# Altium schematic sheet Liv_Flo_Sign_LED_V1.0.SchDoc: Liv-Flo Sign (part 1 of 2)
size 594 x 420 mm; PageSetup: Record=PageOptions|CenterHorizontal=True|CenterVertical=True|PrintScale=0.97|XCorrection=1.00|YCorrection=1.00|PrintKind=0|BorderSize=5000000|LeftOffset=0|BottomOffset=0|Orientation=2|PaperLength=1000|PaperWidth=1000|Scale=100|PaperSource=7|PrintQuality=-3|MediaType=1|DitherType=10|PrintScaleMode=1|PaperKind=A4|PaperIndex=9; Organization: Crelin; Address2: Florian Baumgartner; DocumentNumber: LEDs; Revision: V1.0; SheetNumber: 2; SheetTotal: 2; Author: Florian Baumgartner; Subtitle: Vertically Mounted Daughter-Board
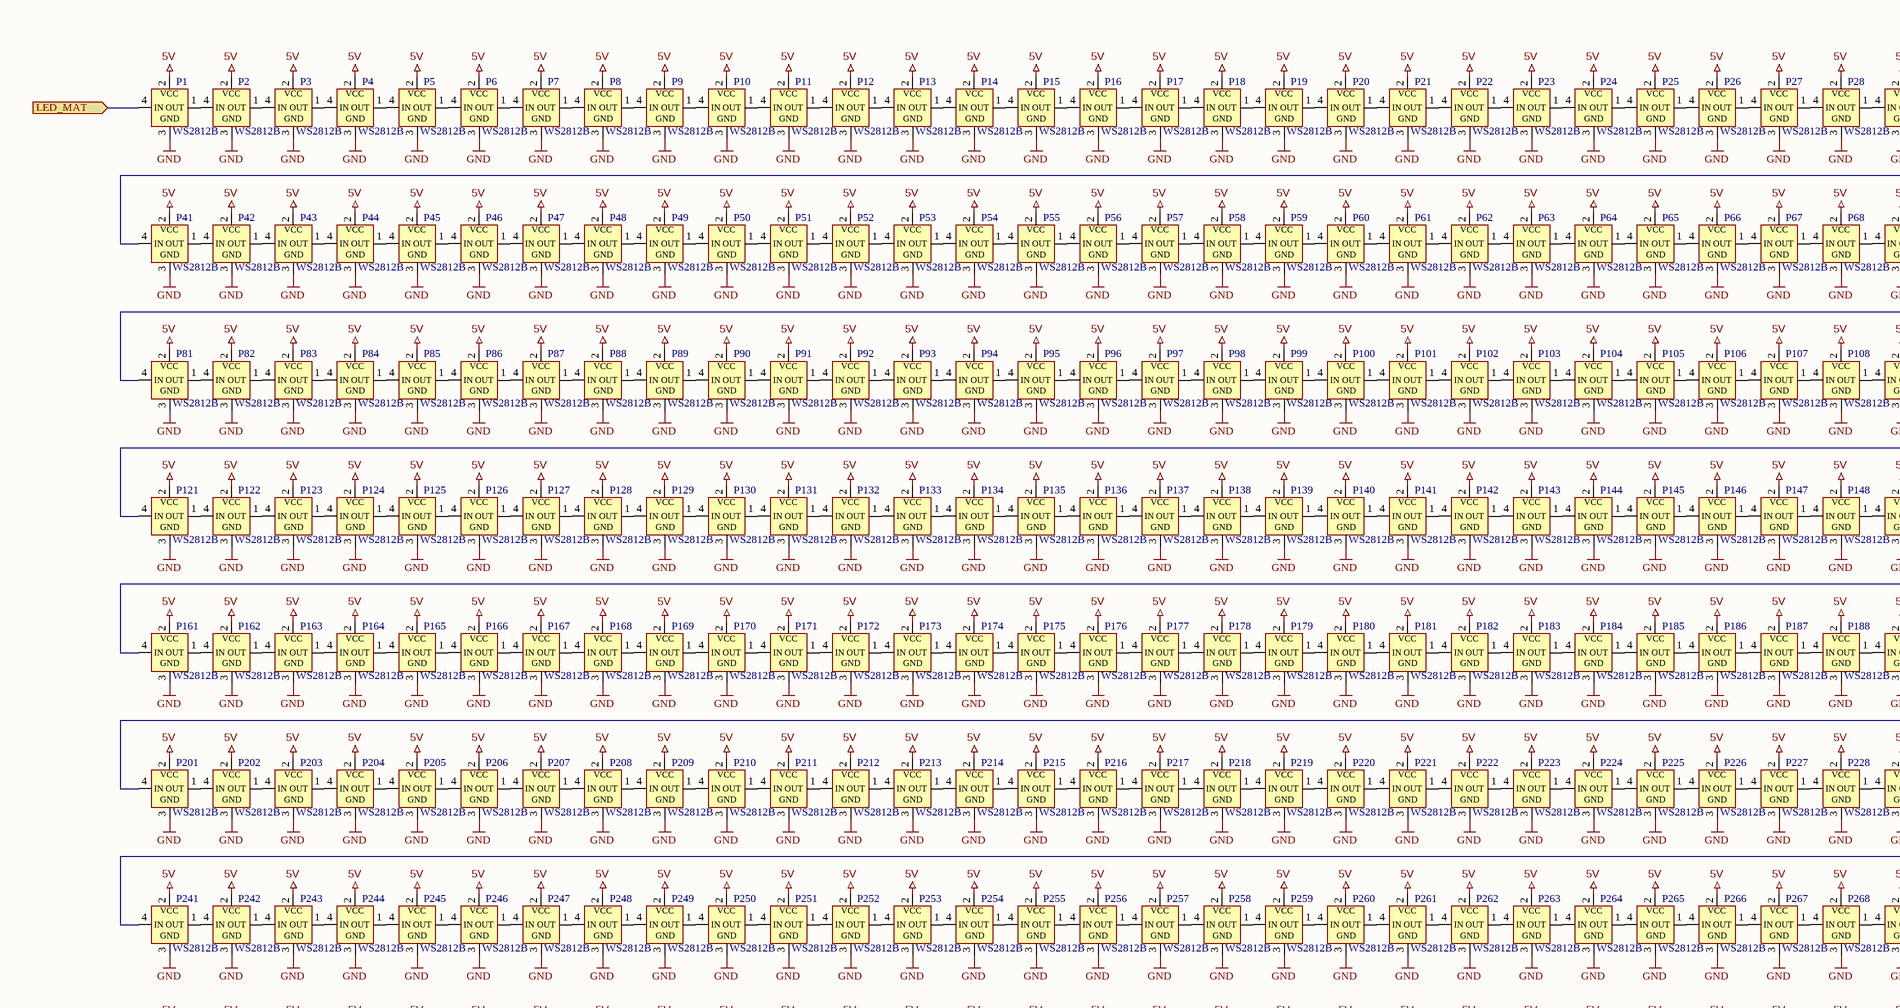
[diagram p0: Liv_Flo_Sign_LED_V1.0.SchDoc, top left]
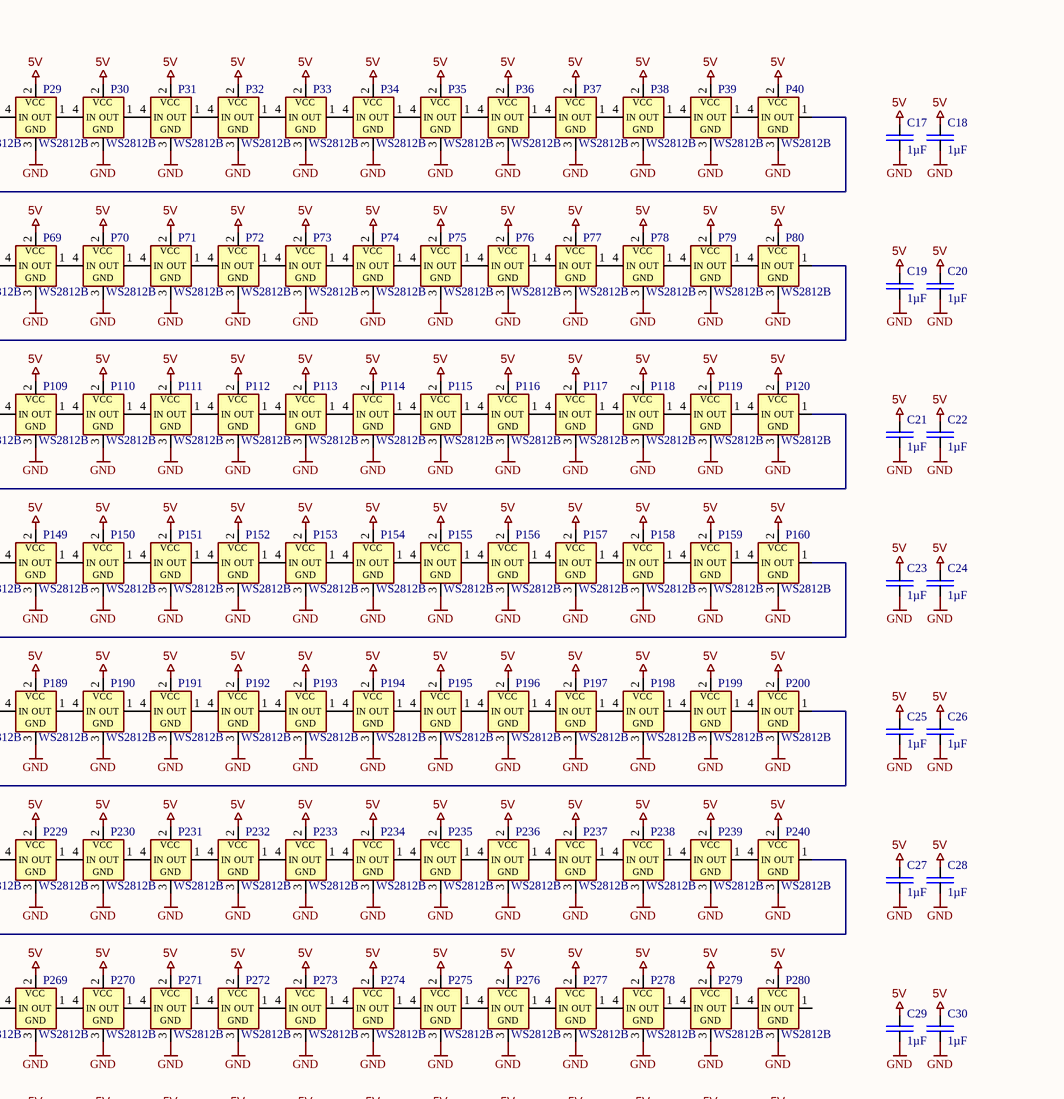
[diagram p1: Liv_Flo_Sign_LED_V1.0.SchDoc, top right]
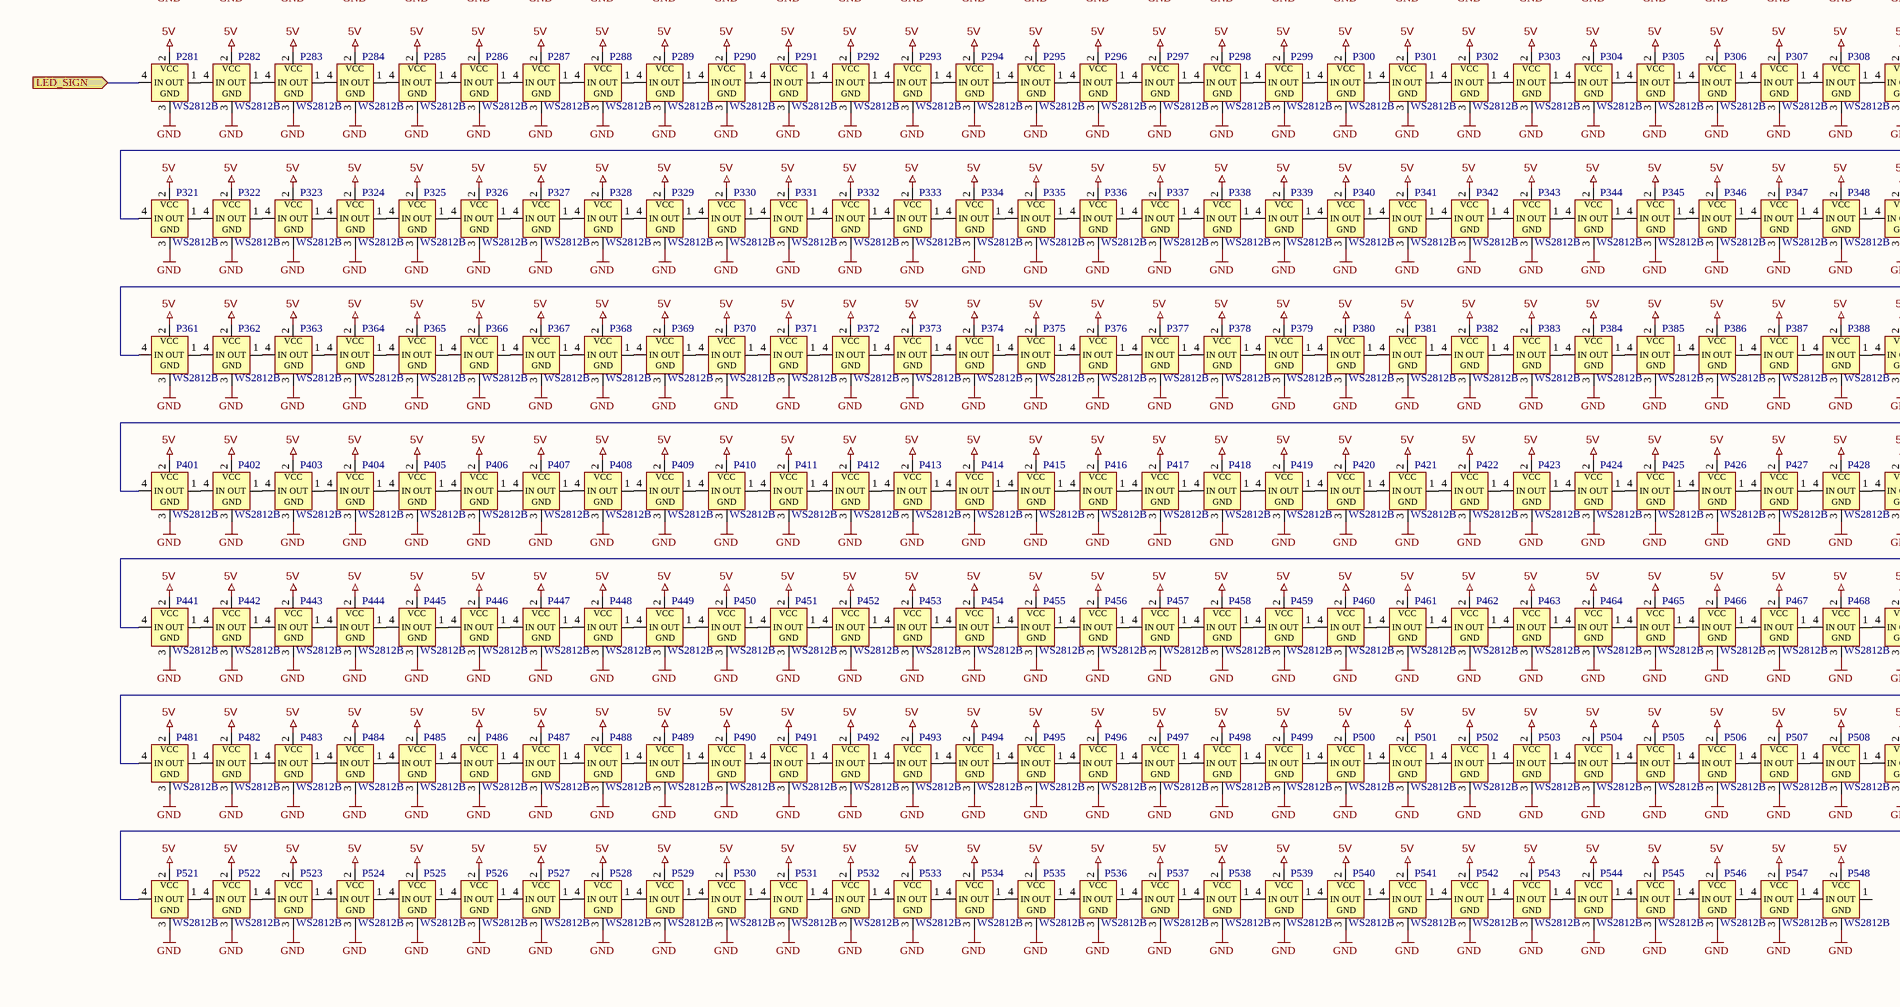
[diagram p2: Liv_Flo_Sign_LED_V1.0.SchDoc, bottom left]
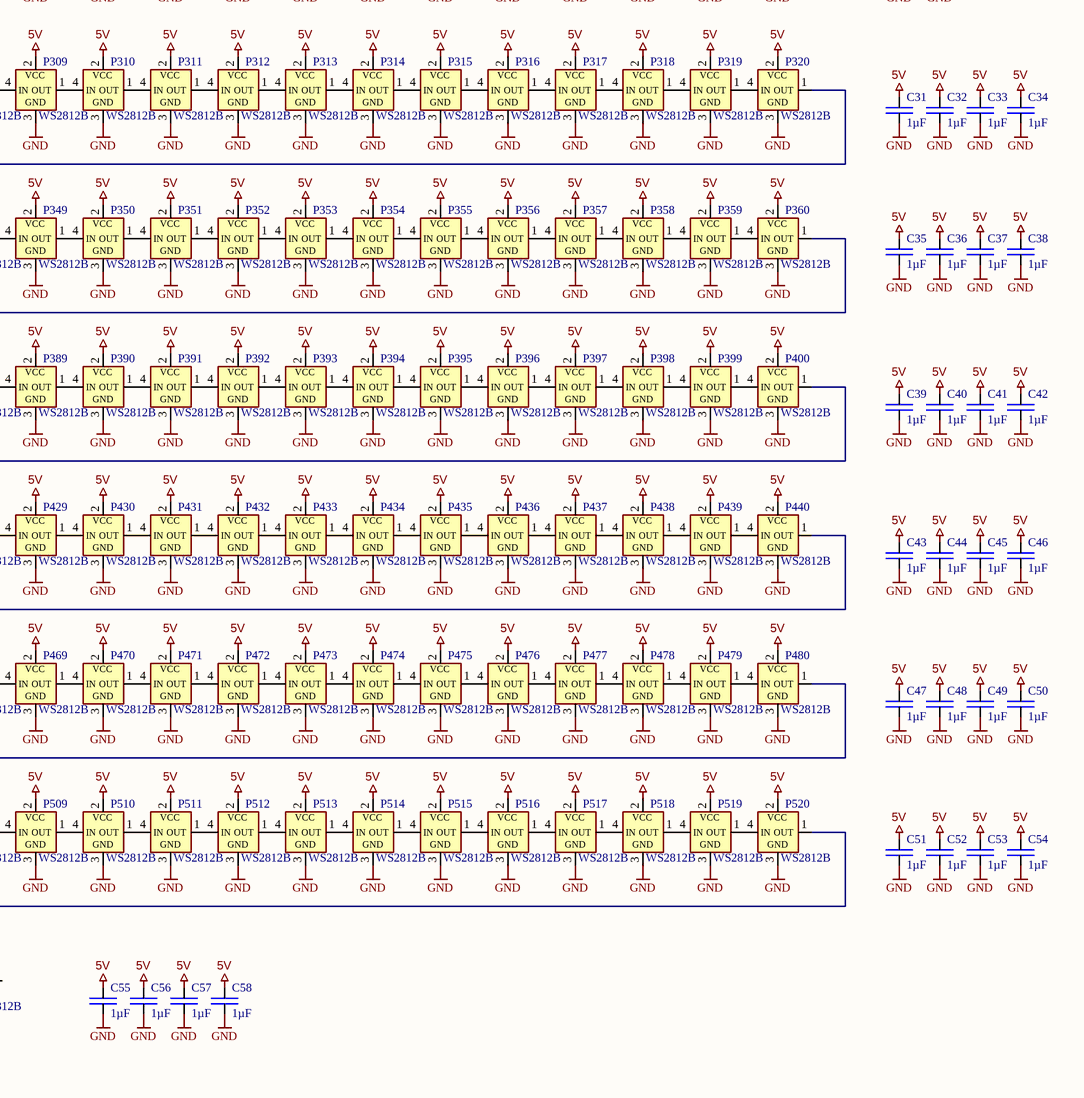
[diagram p3: Liv_Flo_Sign_LED_V1.0.SchDoc, bottom right]

## Parts
C17  1µF  [SMD Keramikkondensator 0402]
C18  1µF  [SMD Keramikkondensator 0402]
C19  1µF  [SMD Keramikkondensator 0402]
C20  1µF  [SMD Keramikkondensator 0402]
C21  1µF  [SMD Keramikkondensator 0402]
C22  1µF  [SMD Keramikkondensator 0402]
C23  1µF  [SMD Keramikkondensator 0402]
C24  1µF  [SMD Keramikkondensator 0402]
C25  1µF  [SMD Keramikkondensator 0402]
C26  1µF  [SMD Keramikkondensator 0402]
C27  1µF  [SMD Keramikkondensator 0402]
C28  1µF  [SMD Keramikkondensator 0402]
C29  1µF  [SMD Keramikkondensator 0402]
C30  1µF  [SMD Keramikkondensator 0402]
C31  1µF  [SMD Keramikkondensator 0402]
C32  1µF  [SMD Keramikkondensator 0402]
C33  1µF  [SMD Keramikkondensator 0402]
C34  1µF  [SMD Keramikkondensator 0402]
C35  1µF  [SMD Keramikkondensator 0402]
C36  1µF  [SMD Keramikkondensator 0402]
C37  1µF  [SMD Keramikkondensator 0402]
C38  1µF  [SMD Keramikkondensator 0402]
C39  1µF  [SMD Keramikkondensator 0402]
C40  1µF  [SMD Keramikkondensator 0402]
C41  1µF  [SMD Keramikkondensator 0402]
C42  1µF  [SMD Keramikkondensator 0402]
C43  1µF  [SMD Keramikkondensator 0402]
C44  1µF  [SMD Keramikkondensator 0402]
C45  1µF  [SMD Keramikkondensator 0402]
C46  1µF  [SMD Keramikkondensator 0402]
C47  1µF  [SMD Keramikkondensator 0402]
C48  1µF  [SMD Keramikkondensator 0402]
C49  1µF  [SMD Keramikkondensator 0402]
C50  1µF  [SMD Keramikkondensator 0402]
C51  1µF  [SMD Keramikkondensator 0402]
C52  1µF  [SMD Keramikkondensator 0402]
C53  1µF  [SMD Keramikkondensator 0402]
C54  1µF  [SMD Keramikkondensator 0402]
C55  1µF  [SMD Keramikkondensator 0402]
C56  1µF  [SMD Keramikkondensator 0402]
C57  1µF  [SMD Keramikkondensator 0402]
C58  1µF  [SMD Keramikkondensator 0402]
P1  WS2812B  [SMD LED WS2812B-1010RGBC]
P2  WS2812B  [SMD LED WS2812B-1010RGBC]
P3  WS2812B  [SMD LED WS2812B-1010RGBC]
P4  WS2812B  [SMD LED WS2812B-1010RGBC]
P5  WS2812B  [SMD LED WS2812B-1010RGBC]
P6  WS2812B  [SMD LED WS2812B-1010RGBC]
P7  WS2812B  [SMD LED WS2812B-1010RGBC]
P8  WS2812B  [SMD LED WS2812B-1010RGBC]
P9  WS2812B  [SMD LED WS2812B-1010RGBC]
P10  WS2812B  [SMD LED WS2812B-1010RGBC]
P11  WS2812B  [SMD LED WS2812B-1010RGBC]
P12  WS2812B  [SMD LED WS2812B-1010RGBC]
P13  WS2812B  [SMD LED WS2812B-1010RGBC]
P14  WS2812B  [SMD LED WS2812B-1010RGBC]
P15  WS2812B  [SMD LED WS2812B-1010RGBC]
P16  WS2812B  [SMD LED WS2812B-1010RGBC]
P17  WS2812B  [SMD LED WS2812B-1010RGBC]
P18  WS2812B  [SMD LED WS2812B-1010RGBC]
P19  WS2812B  [SMD LED WS2812B-1010RGBC]
P20  WS2812B  [SMD LED WS2812B-1010RGBC]
P21  WS2812B  [SMD LED WS2812B-1010RGBC]
P22  WS2812B  [SMD LED WS2812B-1010RGBC]
P23  WS2812B  [SMD LED WS2812B-1010RGBC]
P24  WS2812B  [SMD LED WS2812B-1010RGBC]
P25  WS2812B  [SMD LED WS2812B-1010RGBC]
P26  WS2812B  [SMD LED WS2812B-1010RGBC]
P27  WS2812B  [SMD LED WS2812B-1010RGBC]
P28  WS2812B  [SMD LED WS2812B-1010RGBC]
P29  WS2812B  [SMD LED WS2812B-1010RGBC]
P30  WS2812B  [SMD LED WS2812B-1010RGBC]
P31  WS2812B  [SMD LED WS2812B-1010RGBC]
P32  WS2812B  [SMD LED WS2812B-1010RGBC]
P33  WS2812B  [SMD LED WS2812B-1010RGBC]
P34  WS2812B  [SMD LED WS2812B-1010RGBC]
P35  WS2812B  [SMD LED WS2812B-1010RGBC]
P36  WS2812B  [SMD LED WS2812B-1010RGBC]
P37  WS2812B  [SMD LED WS2812B-1010RGBC]
P38  WS2812B  [SMD LED WS2812B-1010RGBC]
P39  WS2812B  [SMD LED WS2812B-1010RGBC]
P40  WS2812B  [SMD LED WS2812B-1010RGBC]
P41  WS2812B  [SMD LED WS2812B-1010RGBC]
P42  WS2812B  [SMD LED WS2812B-1010RGBC]
P43  WS2812B  [SMD LED WS2812B-1010RGBC]
P44  WS2812B  [SMD LED WS2812B-1010RGBC]
P45  WS2812B  [SMD LED WS2812B-1010RGBC]
P46  WS2812B  [SMD LED WS2812B-1010RGBC]
P47  WS2812B  [SMD LED WS2812B-1010RGBC]
P48  WS2812B  [SMD LED WS2812B-1010RGBC]
P49  WS2812B  [SMD LED WS2812B-1010RGBC]
P50  WS2812B  [SMD LED WS2812B-1010RGBC]
P51  WS2812B  [SMD LED WS2812B-1010RGBC]
P52  WS2812B  [SMD LED WS2812B-1010RGBC]
P53  WS2812B  [SMD LED WS2812B-1010RGBC]
P54  WS2812B  [SMD LED WS2812B-1010RGBC]
P55  WS2812B  [SMD LED WS2812B-1010RGBC]
P56  WS2812B  [SMD LED WS2812B-1010RGBC]
P57  WS2812B  [SMD LED WS2812B-1010RGBC]
P58  WS2812B  [SMD LED WS2812B-1010RGBC]
P59  WS2812B  [SMD LED WS2812B-1010RGBC]
P60  WS2812B  [SMD LED WS2812B-1010RGBC]
P61  WS2812B  [SMD LED WS2812B-1010RGBC]
P62  WS2812B  [SMD LED WS2812B-1010RGBC]
P63  WS2812B  [SMD LED WS2812B-1010RGBC]
P64  WS2812B  [SMD LED WS2812B-1010RGBC]
P65  WS2812B  [SMD LED WS2812B-1010RGBC]
P66  WS2812B  [SMD LED WS2812B-1010RGBC]
P67  WS2812B  [SMD LED WS2812B-1010RGBC]
P68  WS2812B  [SMD LED WS2812B-1010RGBC]
P69  WS2812B  [SMD LED WS2812B-1010RGBC]
P70  WS2812B  [SMD LED WS2812B-1010RGBC]
P71  WS2812B  [SMD LED WS2812B-1010RGBC]
P72  WS2812B  [SMD LED WS2812B-1010RGBC]
P73  WS2812B  [SMD LED WS2812B-1010RGBC]
P74  WS2812B  [SMD LED WS2812B-1010RGBC]
P75  WS2812B  [SMD LED WS2812B-1010RGBC]
P76  WS2812B  [SMD LED WS2812B-1010RGBC]
P77  WS2812B  [SMD LED WS2812B-1010RGBC]
P78  WS2812B  [SMD LED WS2812B-1010RGBC]
P79  WS2812B  [SMD LED WS2812B-1010RGBC]
P80  WS2812B  [SMD LED WS2812B-1010RGBC]
P81  WS2812B  [SMD LED WS2812B-1010RGBC]
P82  WS2812B  [SMD LED WS2812B-1010RGBC]
P83  WS2812B  [SMD LED WS2812B-1010RGBC]
P84  WS2812B  [SMD LED WS2812B-1010RGBC]
P85  WS2812B  [SMD LED WS2812B-1010RGBC]
P86  WS2812B  [SMD LED WS2812B-1010RGBC]
P87  WS2812B  [SMD LED WS2812B-1010RGBC]
P88  WS2812B  [SMD LED WS2812B-1010RGBC]
P89  WS2812B  [SMD LED WS2812B-1010RGBC]
P90  WS2812B  [SMD LED WS2812B-1010RGBC]
P91  WS2812B  [SMD LED WS2812B-1010RGBC]
P92  WS2812B  [SMD LED WS2812B-1010RGBC]
P93  WS2812B  [SMD LED WS2812B-1010RGBC]
P94  WS2812B  [SMD LED WS2812B-1010RGBC]
P95  WS2812B  [SMD LED WS2812B-1010RGBC]
P96  WS2812B  [SMD LED WS2812B-1010RGBC]
P97  WS2812B  [SMD LED WS2812B-1010RGBC]
P98  WS2812B  [SMD LED WS2812B-1010RGBC]
P99  WS2812B  [SMD LED WS2812B-1010RGBC]
P100  WS2812B  [SMD LED WS2812B-1010RGBC]
P101  WS2812B  [SMD LED WS2812B-1010RGBC]
P102  WS2812B  [SMD LED WS2812B-1010RGBC]
P103  WS2812B  [SMD LED WS2812B-1010RGBC]
P104  WS2812B  [SMD LED WS2812B-1010RGBC]
P105  WS2812B  [SMD LED WS2812B-1010RGBC]
P106  WS2812B  [SMD LED WS2812B-1010RGBC]
P107  WS2812B  [SMD LED WS2812B-1010RGBC]
P108  WS2812B  [SMD LED WS2812B-1010RGBC]
P109  WS2812B  [SMD LED WS2812B-1010RGBC]
P110  WS2812B  [SMD LED WS2812B-1010RGBC]
P111  WS2812B  [SMD LED WS2812B-1010RGBC]
P112  WS2812B  [SMD LED WS2812B-1010RGBC]
P113  WS2812B  [SMD LED WS2812B-1010RGBC]
P114  WS2812B  [SMD LED WS2812B-1010RGBC]
P115  WS2812B  [SMD LED WS2812B-1010RGBC]
P116  WS2812B  [SMD LED WS2812B-1010RGBC]
P117  WS2812B  [SMD LED WS2812B-1010RGBC]
P118  WS2812B  [SMD LED WS2812B-1010RGBC]
P119  WS2812B  [SMD LED WS2812B-1010RGBC]
P120  WS2812B  [SMD LED WS2812B-1010RGBC]
P121  WS2812B  [SMD LED WS2812B-1010RGBC]
P122  WS2812B  [SMD LED WS2812B-1010RGBC]
P123  WS2812B  [SMD LED WS2812B-1010RGBC]
P124  WS2812B  [SMD LED WS2812B-1010RGBC]
P125  WS2812B  [SMD LED WS2812B-1010RGBC]
P126  WS2812B  [SMD LED WS2812B-1010RGBC]
P127  WS2812B  [SMD LED WS2812B-1010RGBC]
P128  WS2812B  [SMD LED WS2812B-1010RGBC]
P129  WS2812B  [SMD LED WS2812B-1010RGBC]
P130  WS2812B  [SMD LED WS2812B-1010RGBC]
P131  WS2812B  [SMD LED WS2812B-1010RGBC]
P132  WS2812B  [SMD LED WS2812B-1010RGBC]
P133  WS2812B  [SMD LED WS2812B-1010RGBC]
P134  WS2812B  [SMD LED WS2812B-1010RGBC]
P135  WS2812B  [SMD LED WS2812B-1010RGBC]
P136  WS2812B  [SMD LED WS2812B-1010RGBC]
P137  WS2812B  [SMD LED WS2812B-1010RGBC]
P138  WS2812B  [SMD LED WS2812B-1010RGBC]
P139  WS2812B  [SMD LED WS2812B-1010RGBC]
P140  WS2812B  [SMD LED WS2812B-1010RGBC]
P141  WS2812B  [SMD LED WS2812B-1010RGBC]
P142  WS2812B  [SMD LED WS2812B-1010RGBC]
P143  WS2812B  [SMD LED WS2812B-1010RGBC]
P144  WS2812B  [SMD LED WS2812B-1010RGBC]
P145  WS2812B  [SMD LED WS2812B-1010RGBC]
P146  WS2812B  [SMD LED WS2812B-1010RGBC]
P147  WS2812B  [SMD LED WS2812B-1010RGBC]
P148  WS2812B  [SMD LED WS2812B-1010RGBC]
P149  WS2812B  [SMD LED WS2812B-1010RGBC]
P150  WS2812B  [SMD LED WS2812B-1010RGBC]
P151  WS2812B  [SMD LED WS2812B-1010RGBC]
P152  WS2812B  [SMD LED WS2812B-1010RGBC]
P153  WS2812B  [SMD LED WS2812B-1010RGBC]
P154  WS2812B  [SMD LED WS2812B-1010RGBC]
P155  WS2812B  [SMD LED WS2812B-1010RGBC]
P156  WS2812B  [SMD LED WS2812B-1010RGBC]
P157  WS2812B  [SMD LED WS2812B-1010RGBC]
P158  WS2812B  [SMD LED WS2812B-1010RGBC]
P159  WS2812B  [SMD LED WS2812B-1010RGBC]
P160  WS2812B  [SMD LED WS2812B-1010RGBC]
P161  WS2812B  [SMD LED WS2812B-1010RGBC]
P162  WS2812B  [SMD LED WS2812B-1010RGBC]
P163  WS2812B  [SMD LED WS2812B-1010RGBC]
P164  WS2812B  [SMD LED WS2812B-1010RGBC]
P165  WS2812B  [SMD LED WS2812B-1010RGBC]
P166  WS2812B  [SMD LED WS2812B-1010RGBC]
P167  WS2812B  [SMD LED WS2812B-1010RGBC]
P168  WS2812B  [SMD LED WS2812B-1010RGBC]
P169  WS2812B  [SMD LED WS2812B-1010RGBC]
P170  WS2812B  [SMD LED WS2812B-1010RGBC]
P171  WS2812B  [SMD LED WS2812B-1010RGBC]
P172  WS2812B  [SMD LED WS2812B-1010RGBC]
P173  WS2812B  [SMD LED WS2812B-1010RGBC]
P174  WS2812B  [SMD LED WS2812B-1010RGBC]
P175  WS2812B  [SMD LED WS2812B-1010RGBC]
P176  WS2812B  [SMD LED WS2812B-1010RGBC]
P177  WS2812B  [SMD LED WS2812B-1010RGBC]
P178  WS2812B  [SMD LED WS2812B-1010RGBC]
P179  WS2812B  [SMD LED WS2812B-1010RGBC]
P180  WS2812B  [SMD LED WS2812B-1010RGBC]
P181  WS2812B  [SMD LED WS2812B-1010RGBC]
P182  WS2812B  [SMD LED WS2812B-1010RGBC]
P183  WS2812B  [SMD LED WS2812B-1010RGBC]
P184  WS2812B  [SMD LED WS2812B-1010RGBC]
P185  WS2812B  [SMD LED WS2812B-1010RGBC]
P186  WS2812B  [SMD LED WS2812B-1010RGBC]
P187  WS2812B  [SMD LED WS2812B-1010RGBC]
P188  WS2812B  [SMD LED WS2812B-1010RGBC]
P189  WS2812B  [SMD LED WS2812B-1010RGBC]
P190  WS2812B  [SMD LED WS2812B-1010RGBC]
P191  WS2812B  [SMD LED WS2812B-1010RGBC]
P192  WS2812B  [SMD LED WS2812B-1010RGBC]
P193  WS2812B  [SMD LED WS2812B-1010RGBC]
P194  WS2812B  [SMD LED WS2812B-1010RGBC]
P195  WS2812B  [SMD LED WS2812B-1010RGBC]
P196  WS2812B  [SMD LED WS2812B-1010RGBC]
P197  WS2812B  [SMD LED WS2812B-1010RGBC]
P198  WS2812B  [SMD LED WS2812B-1010RGBC]
P199  WS2812B  [SMD LED WS2812B-1010RGBC]
P200  WS2812B  [SMD LED WS2812B-1010RGBC]
P201  WS2812B  [SMD LED WS2812B-1010RGBC]
P202  WS2812B  [SMD LED WS2812B-1010RGBC]
P203  WS2812B  [SMD LED WS2812B-1010RGBC]
P204  WS2812B  [SMD LED WS2812B-1010RGBC]
P205  WS2812B  [SMD LED WS2812B-1010RGBC]
P206  WS2812B  [SMD LED WS2812B-1010RGBC]
P207  WS2812B  [SMD LED WS2812B-1010RGBC]
P208  WS2812B  [SMD LED WS2812B-1010RGBC]
P209  WS2812B  [SMD LED WS2812B-1010RGBC]
P210  WS2812B  [SMD LED WS2812B-1010RGBC]
P211  WS2812B  [SMD LED WS2812B-1010RGBC]
P212  WS2812B  [SMD LED WS2812B-1010RGBC]
P213  WS2812B  [SMD LED WS2812B-1010RGBC]
P214  WS2812B  [SMD LED WS2812B-1010RGBC]
P215  WS2812B  [SMD LED WS2812B-1010RGBC]
P216  WS2812B  [SMD LED WS2812B-1010RGBC]
P217  WS2812B  [SMD LED WS2812B-1010RGBC]
P218  WS2812B  [SMD LED WS2812B-1010RGBC]
P219  WS2812B  [SMD LED WS2812B-1010RGBC]
P220  WS2812B  [SMD LED WS2812B-1010RGBC]
P221  WS2812B  [SMD LED WS2812B-1010RGBC]
P222  WS2812B  [SMD LED WS2812B-1010RGBC]
P223  WS2812B  [SMD LED WS2812B-1010RGBC]
P224  WS2812B  [SMD LED WS2812B-1010RGBC]
P225  WS2812B  [SMD LED WS2812B-1010RGBC]
P226  WS2812B  [SMD LED WS2812B-1010RGBC]
P227  WS2812B  [SMD LED WS2812B-1010RGBC]
P228  WS2812B  [SMD LED WS2812B-1010RGBC]
P229  WS2812B  [SMD LED WS2812B-1010RGBC]
P230  WS2812B  [SMD LED WS2812B-1010RGBC]
P231  WS2812B  [SMD LED WS2812B-1010RGBC]
P232  WS2812B  [SMD LED WS2812B-1010RGBC]
P233  WS2812B  [SMD LED WS2812B-1010RGBC]
P234  WS2812B  [SMD LED WS2812B-1010RGBC]
P235  WS2812B  [SMD LED WS2812B-1010RGBC]
P236  WS2812B  [SMD LED WS2812B-1010RGBC]
P237  WS2812B  [SMD LED WS2812B-1010RGBC]
P238  WS2812B  [SMD LED WS2812B-1010RGBC]
P239  WS2812B  [SMD LED WS2812B-1010RGBC]
P240  WS2812B  [SMD LED WS2812B-1010RGBC]
P241  WS2812B  [SMD LED WS2812B-1010RGBC]
P242  WS2812B  [SMD LED WS2812B-1010RGBC]
P243  WS2812B  [SMD LED WS2812B-1010RGBC]
P244  WS2812B  [SMD LED WS2812B-1010RGBC]
P245  WS2812B  [SMD LED WS2812B-1010RGBC]
P246  WS2812B  [SMD LED WS2812B-1010RGBC]
P247  WS2812B  [SMD LED WS2812B-1010RGBC]
P248  WS2812B  [SMD LED WS2812B-1010RGBC]
P249  WS2812B  [SMD LED WS2812B-1010RGBC]
P250  WS2812B  [SMD LED WS2812B-1010RGBC]
P251  WS2812B  [SMD LED WS2812B-1010RGBC]
P252  WS2812B  [SMD LED WS2812B-1010RGBC]
P253  WS2812B  [SMD LED WS2812B-1010RGBC]
P254  WS2812B  [SMD LED WS2812B-1010RGBC]
P255  WS2812B  [SMD LED WS2812B-1010RGBC]
P256  WS2812B  [SMD LED WS2812B-1010RGBC]
P257  WS2812B  [SMD LED WS2812B-1010RGBC]
P258  WS2812B  [SMD LED WS2812B-1010RGBC]
P259  WS2812B  [SMD LED WS2812B-1010RGBC]
P260  WS2812B  [SMD LED WS2812B-1010RGBC]
P261  WS2812B  [SMD LED WS2812B-1010RGBC]
P262  WS2812B  [SMD LED WS2812B-1010RGBC]
P263  WS2812B  [SMD LED WS2812B-1010RGBC]
P264  WS2812B  [SMD LED WS2812B-1010RGBC]
P265  WS2812B  [SMD LED WS2812B-1010RGBC]
P266  WS2812B  [SMD LED WS2812B-1010RGBC]
P267  WS2812B  [SMD LED WS2812B-1010RGBC]
P268  WS2812B  [SMD LED WS2812B-1010RGBC]
P269  WS2812B  [SMD LED WS2812B-1010RGBC]
P270  WS2812B  [SMD LED WS2812B-1010RGBC]
P271  WS2812B  [SMD LED WS2812B-1010RGBC]
P272  WS2812B  [SMD LED WS2812B-1010RGBC]
P273  WS2812B  [SMD LED WS2812B-1010RGBC]
P274  WS2812B  [SMD LED WS2812B-1010RGBC]
P275  WS2812B  [SMD LED WS2812B-1010RGBC]
P276  WS2812B  [SMD LED WS2812B-1010RGBC]
P277  WS2812B  [SMD LED WS2812B-1010RGBC]
P278  WS2812B  [SMD LED WS2812B-1010RGBC]
P279  WS2812B  [SMD LED WS2812B-1010RGBC]
P280  WS2812B  [SMD LED WS2812B-1010RGBC]
P281  WS2812B  [SMD LED WS2812B-1010RGBC]
P282  WS2812B  [SMD LED WS2812B-1010RGBC]
P283  WS2812B  [SMD LED WS2812B-1010RGBC]
P284  WS2812B  [SMD LED WS2812B-1010RGBC]
P285  WS2812B  [SMD LED WS2812B-1010RGBC]
P286  WS2812B  [SMD LED WS2812B-1010RGBC]
P287  WS2812B  [SMD LED WS2812B-1010RGBC]
P288  WS2812B  [SMD LED WS2812B-1010RGBC]
P289  WS2812B  [SMD LED WS2812B-1010RGBC]
P290  WS2812B  [SMD LED WS2812B-1010RGBC]
P291  WS2812B  [SMD LED WS2812B-1010RGBC]
P292  WS2812B  [SMD LED WS2812B-1010RGBC]
P293  WS2812B  [SMD LED WS2812B-1010RGBC]
P294  WS2812B  [SMD LED WS2812B-1010RGBC]
P295  WS2812B  [SMD LED WS2812B-1010RGBC]
P296  WS2812B  [SMD LED WS2812B-1010RGBC]
P297  WS2812B  [SMD LED WS2812B-1010RGBC]
P298  WS2812B  [SMD LED WS2812B-1010RGBC]
P299  WS2812B  [SMD LED WS2812B-1010RGBC]
P300  WS2812B  [SMD LED WS2812B-1010RGBC]
P301  WS2812B  [SMD LED WS2812B-1010RGBC]
P302  WS2812B  [SMD LED WS2812B-1010RGBC]
P303  WS2812B  [SMD LED WS2812B-1010RGBC]
P304  WS2812B  [SMD LED WS2812B-1010RGBC]
P305  WS2812B  [SMD LED WS2812B-1010RGBC]
P306  WS2812B  [SMD LED WS2812B-1010RGBC]
P307  WS2812B  [SMD LED WS2812B-1010RGBC]
P308  WS2812B  [SMD LED WS2812B-1010RGBC]
P309  WS2812B  [SMD LED WS2812B-1010RGBC]
P310  WS2812B  [SMD LED WS2812B-1010RGBC]
P311  WS2812B  [SMD LED WS2812B-1010RGBC]
P312  WS2812B  [SMD LED WS2812B-1010RGBC]
P313  WS2812B  [SMD LED WS2812B-1010RGBC]
P314  WS2812B  [SMD LED WS2812B-1010RGBC]
P315  WS2812B  [SMD LED WS2812B-1010RGBC]
P316  WS2812B  [SMD LED WS2812B-1010RGBC]
P317  WS2812B  [SMD LED WS2812B-1010RGBC]
P318  WS2812B  [SMD LED WS2812B-1010RGBC]
P319  WS2812B  [SMD LED WS2812B-1010RGBC]
P320  WS2812B  [SMD LED WS2812B-1010RGBC]
P321  WS2812B  [SMD LED WS2812B-1010RGBC]
P322  WS2812B  [SMD LED WS2812B-1010RGBC]
P323  WS2812B  [SMD LED WS2812B-1010RGBC]
P324  WS2812B  [SMD LED WS2812B-1010RGBC]
P325  WS2812B  [SMD LED WS2812B-1010RGBC]
P326  WS2812B  [SMD LED WS2812B-1010RGBC]
P327  WS2812B  [SMD LED WS2812B-1010RGBC]
P328  WS2812B  [SMD LED WS2812B-1010RGBC]
P329  WS2812B  [SMD LED WS2812B-1010RGBC]
P330  WS2812B  [SMD LED WS2812B-1010RGBC]
P331  WS2812B  [SMD LED WS2812B-1010RGBC]
P332  WS2812B  [SMD LED WS2812B-1010RGBC]
P333  WS2812B  [SMD LED WS2812B-1010RGBC]
P334  WS2812B  [SMD LED WS2812B-1010RGBC]
P335  WS2812B  [SMD LED WS2812B-1010RGBC]
P336  WS2812B  [SMD LED WS2812B-1010RGBC]
P337  WS2812B  [SMD LED WS2812B-1010RGBC]
P338  WS2812B  [SMD LED WS2812B-1010RGBC]
P339  WS2812B  [SMD LED WS2812B-1010RGBC]
P340  WS2812B  [SMD LED WS2812B-1010RGBC]
P341  WS2812B  [SMD LED WS2812B-1010RGBC]
P342  WS2812B  [SMD LED WS2812B-1010RGBC]
P343  WS2812B  [SMD LED WS2812B-1010RGBC]
P344  WS2812B  [SMD LED WS2812B-1010RGBC]
P345  WS2812B  [SMD LED WS2812B-1010RGBC]
P346  WS2812B  [SMD LED WS2812B-1010RGBC]
P347  WS2812B  [SMD LED WS2812B-1010RGBC]
P348  WS2812B  [SMD LED WS2812B-1010RGBC]
P349  WS2812B  [SMD LED WS2812B-1010RGBC]
P350  WS2812B  [SMD LED WS2812B-1010RGBC]
P351  WS2812B  [SMD LED WS2812B-1010RGBC]
P352  WS2812B  [SMD LED WS2812B-1010RGBC]
P353  WS2812B  [SMD LED WS2812B-1010RGBC]
P354  WS2812B  [SMD LED WS2812B-1010RGBC]
P355  WS2812B  [SMD LED WS2812B-1010RGBC]
P356  WS2812B  [SMD LED WS2812B-1010RGBC]
P357  WS2812B  [SMD LED WS2812B-1010RGBC]
P358  WS2812B  [SMD LED WS2812B-1010RGBC]
P359  WS2812B  [SMD LED WS2812B-1010RGBC]
P360  WS2812B  [SMD LED WS2812B-1010RGBC]
P361  WS2812B  [SMD LED WS2812B-1010RGBC]
P362  WS2812B  [SMD LED WS2812B-1010RGBC]
P363  WS2812B  [SMD LED WS2812B-1010RGBC]
P364  WS2812B  [SMD LED WS2812B-1010RGBC]
P365  WS2812B  [SMD LED WS2812B-1010RGBC]
P366  WS2812B  [SMD LED WS2812B-1010RGBC]
P367  WS2812B  [SMD LED WS2812B-1010RGBC]
P368  WS2812B  [SMD LED WS2812B-1010RGBC]
P369  WS2812B  [SMD LED WS2812B-1010RGBC]
P370  WS2812B  [SMD LED WS2812B-1010RGBC]
P371  WS2812B  [SMD LED WS2812B-1010RGBC]
P372  WS2812B  [SMD LED WS2812B-1010RGBC]
P373  WS2812B  [SMD LED WS2812B-1010RGBC]
P374  WS2812B  [SMD LED WS2812B-1010RGBC]
P375  WS2812B  [SMD LED WS2812B-1010RGBC]
P376  WS2812B  [SMD LED WS2812B-1010RGBC]
P377  WS2812B  [SMD LED WS2812B-1010RGBC]
P378  WS2812B  [SMD LED WS2812B-1010RGBC]
P379  WS2812B  [SMD LED WS2812B-1010RGBC]
P380  WS2812B  [SMD LED WS2812B-1010RGBC]
P381  WS2812B  [SMD LED WS2812B-1010RGBC]
P382  WS2812B  [SMD LED WS2812B-1010RGBC]
P383  WS2812B  [SMD LED WS2812B-1010RGBC]
P384  WS2812B  [SMD LED WS2812B-1010RGBC]
P385  WS2812B  [SMD LED WS2812B-1010RGBC]
P386  WS2812B  [SMD LED WS2812B-1010RGBC]
P387  WS2812B  [SMD LED WS2812B-1010RGBC]
P388  WS2812B  [SMD LED WS2812B-1010RGBC]
P389  WS2812B  [SMD LED WS2812B-1010RGBC]
P390  WS2812B  [SMD LED WS2812B-1010RGBC]
P391  WS2812B  [SMD LED WS2812B-1010RGBC]
P392  WS2812B  [SMD LED WS2812B-1010RGBC]
P393  WS2812B  [SMD LED WS2812B-1010RGBC]
P394  WS2812B  [SMD LED WS2812B-1010RGBC]
P395  WS2812B  [SMD LED WS2812B-1010RGBC]
P396  WS2812B  [SMD LED WS2812B-1010RGBC]
P397  WS2812B  [SMD LED WS2812B-1010RGBC]
P398  WS2812B  [SMD LED WS2812B-1010RGBC]
P399  WS2812B  [SMD LED WS2812B-1010RGBC]
P400  WS2812B  [SMD LED WS2812B-1010RGBC]
P401  WS2812B  [SMD LED WS2812B-1010RGBC]
P402  WS2812B  [SMD LED WS2812B-1010RGBC]
P403  WS2812B  [SMD LED WS2812B-1010RGBC]
P404  WS2812B  [SMD LED WS2812B-1010RGBC]
P405  WS2812B  [SMD LED WS2812B-1010RGBC]
P406  WS2812B  [SMD LED WS2812B-1010RGBC]
P407  WS2812B  [SMD LED WS2812B-1010RGBC]
P408  WS2812B  [SMD LED WS2812B-1010RGBC]
P409  WS2812B  [SMD LED WS2812B-1010RGBC]
P410  WS2812B  [SMD LED WS2812B-1010RGBC]
P411  WS2812B  [SMD LED WS2812B-1010RGBC]
P412  WS2812B  [SMD LED WS2812B-1010RGBC]
P413  WS2812B  [SMD LED WS2812B-1010RGBC]
P414  WS2812B  [SMD LED WS2812B-1010RGBC]
P415  WS2812B  [SMD LED WS2812B-1010RGBC]
P416  WS2812B  [SMD LED WS2812B-1010RGBC]
P417  WS2812B  [SMD LED WS2812B-1010RGBC]
P418  WS2812B  [SMD LED WS2812B-1010RGBC]
P419  WS2812B  [SMD LED WS2812B-1010RGBC]
P420  WS2812B  [SMD LED WS2812B-1010RGBC]
P421  WS2812B  [SMD LED WS2812B-1010RGBC]
P422  WS2812B  [SMD LED WS2812B-1010RGBC]
P423  WS2812B  [SMD LED WS2812B-1010RGBC]
P424  WS2812B  [SMD LED WS2812B-1010RGBC]
P425  WS2812B  [SMD LED WS2812B-1010RGBC]
P426  WS2812B  [SMD LED WS2812B-1010RGBC]
P427  WS2812B  [SMD LED WS2812B-1010RGBC]
P428  WS2812B  [SMD LED WS2812B-1010RGBC]
P429  WS2812B  [SMD LED WS2812B-1010RGBC]
P430  WS2812B  [SMD LED WS2812B-1010RGBC]
P431  WS2812B  [SMD LED WS2812B-1010RGBC]
P432  WS2812B  [SMD LED WS2812B-1010RGBC]
P433  WS2812B  [SMD LED WS2812B-1010RGBC]
P434  WS2812B  [SMD LED WS2812B-1010RGBC]
P435  WS2812B  [SMD LED WS2812B-1010RGBC]
P436  WS2812B  [SMD LED WS2812B-1010RGBC]
P437  WS2812B  [SMD LED WS2812B-1010RGBC]
P438  WS2812B  [SMD LED WS2812B-1010RGBC]
P439  WS2812B  [SMD LED WS2812B-1010RGBC]
P440  WS2812B  [SMD LED WS2812B-1010RGBC]
P441  WS2812B  [SMD LED WS2812B-1010RGBC]
P442  WS2812B  [SMD LED WS2812B-1010RGBC]
P443  WS2812B  [SMD LED WS2812B-1010RGBC]
P444  WS2812B  [SMD LED WS2812B-1010RGBC]
P445  WS2812B  [SMD LED WS2812B-1010RGBC]
P446  WS2812B  [SMD LED WS2812B-1010RGBC]
P447  WS2812B  [SMD LED WS2812B-1010RGBC]
P448  WS2812B  [SMD LED WS2812B-1010RGBC]
P449  WS2812B  [SMD LED WS2812B-1010RGBC]
P450  WS2812B  [SMD LED WS2812B-1010RGBC]
P451  WS2812B  [SMD LED WS2812B-1010RGBC]
P452  WS2812B  [SMD LED WS2812B-1010RGBC]
P453  WS2812B  [SMD LED WS2812B-1010RGBC]
P454  WS2812B  [SMD LED WS2812B-1010RGBC]
P455  WS2812B  [SMD LED WS2812B-1010RGBC]
P456  WS2812B  [SMD LED WS2812B-1010RGBC]
P457  WS2812B  [SMD LED WS2812B-1010RGBC]
P458  WS2812B  [SMD LED WS2812B-1010RGBC]
P459  WS2812B  [SMD LED WS2812B-1010RGBC]
P460  WS2812B  [SMD LED WS2812B-1010RGBC]
P461  WS2812B  [SMD LED WS2812B-1010RGBC]
P462  WS2812B  [SMD LED WS2812B-1010RGBC]
P463  WS2812B  [SMD LED WS2812B-1010RGBC]
P464  WS2812B  [SMD LED WS2812B-1010RGBC]
P465  WS2812B  [SMD LED WS2812B-1010RGBC]
P466  WS2812B  [SMD LED WS2812B-1010RGBC]
P467  WS2812B  [SMD LED WS2812B-1010RGBC]
P468  WS2812B  [SMD LED WS2812B-1010RGBC]
P469  WS2812B  [SMD LED WS2812B-1010RGBC]
P470  WS2812B  [SMD LED WS2812B-1010RGBC]
P471  WS2812B  [SMD LED WS2812B-1010RGBC]
P472  WS2812B  [SMD LED WS2812B-1010RGBC]
P473  WS2812B  [SMD LED WS2812B-1010RGBC]
P474  WS2812B  [SMD LED WS2812B-1010RGBC]
P475  WS2812B  [SMD LED WS2812B-1010RGBC]
P476  WS2812B  [SMD LED WS2812B-1010RGBC]
P477  WS2812B  [SMD LED WS2812B-1010RGBC]
P478  WS2812B  [SMD LED WS2812B-1010RGBC]
P479  WS2812B  [SMD LED WS2812B-1010RGBC]
P480  WS2812B  [SMD LED WS2812B-1010RGBC]
P481  WS2812B  [SMD LED WS2812B-1010RGBC]
P482  WS2812B  [SMD LED WS2812B-1010RGBC]
P483  WS2812B  [SMD LED WS2812B-1010RGBC]
P484  WS2812B  [SMD LED WS2812B-1010RGBC]
P485  WS2812B  [SMD LED WS2812B-1010RGBC]
P486  WS2812B  [SMD LED WS2812B-1010RGBC]
P487  WS2812B  [SMD LED WS2812B-1010RGBC]
P488  WS2812B  [SMD LED WS2812B-1010RGBC]
P489  WS2812B  [SMD LED WS2812B-1010RGBC]
P490  WS2812B  [SMD LED WS2812B-1010RGBC]
P491  WS2812B  [SMD LED WS2812B-1010RGBC]
P492  WS2812B  [SMD LED WS2812B-1010RGBC]
P493  WS2812B  [SMD LED WS2812B-1010RGBC]
P494  WS2812B  [SMD LED WS2812B-1010RGBC]
P495  WS2812B  [SMD LED WS2812B-1010RGBC]
P496  WS2812B  [SMD LED WS2812B-1010RGBC]
P497  WS2812B  [SMD LED WS2812B-1010RGBC]
P498  WS2812B  [SMD LED WS2812B-1010RGBC]
P499  WS2812B  [SMD LED WS2812B-1010RGBC]
P500  WS2812B  [SMD LED WS2812B-1010RGBC]
P501  WS2812B  [SMD LED WS2812B-1010RGBC]
P502  WS2812B  [SMD LED WS2812B-1010RGBC]
P503  WS2812B  [SMD LED WS2812B-1010RGBC]
P504  WS2812B  [SMD LED WS2812B-1010RGBC]
P505  WS2812B  [SMD LED WS2812B-1010RGBC]
P506  WS2812B  [SMD LED WS2812B-1010RGBC]
P507  WS2812B  [SMD LED WS2812B-1010RGBC]
P508  WS2812B  [SMD LED WS2812B-1010RGBC]
P509  WS2812B  [SMD LED WS2812B-1010RGBC]
P510  WS2812B  [SMD LED WS2812B-1010RGBC]
P511  WS2812B  [SMD LED WS2812B-1010RGBC]
P512  WS2812B  [SMD LED WS2812B-1010RGBC]
P513  WS2812B  [SMD LED WS2812B-1010RGBC]
P514  WS2812B  [SMD LED WS2812B-1010RGBC]
P515  WS2812B  [SMD LED WS2812B-1010RGBC]
P516  WS2812B  [SMD LED WS2812B-1010RGBC]
P517  WS2812B  [SMD LED WS2812B-1010RGBC]
P518  WS2812B  [SMD LED WS2812B-1010RGBC]
P519  WS2812B  [SMD LED WS2812B-1010RGBC]
P520  WS2812B  [SMD LED WS2812B-1010RGBC]
P521  WS2812B  [SMD LED WS2812B-1010RGBC]
P522  WS2812B  [SMD LED WS2812B-1010RGBC]
P523  WS2812B  [SMD LED WS2812B-1010RGBC]
P524  WS2812B  [SMD LED WS2812B-1010RGBC]
P525  WS2812B  [SMD LED WS2812B-1010RGBC]
P526  WS2812B  [SMD LED WS2812B-1010RGBC]
P527  WS2812B  [SMD LED WS2812B-1010RGBC]
P528  WS2812B  [SMD LED WS2812B-1010RGBC]
P529  WS2812B  [SMD LED WS2812B-1010RGBC]
P530  WS2812B  [SMD LED WS2812B-1010RGBC]
P531  WS2812B  [SMD LED WS2812B-1010RGBC]
P532  WS2812B  [SMD LED WS2812B-1010RGBC]
P533  WS2812B  [SMD LED WS2812B-1010RGBC]
P534  WS2812B  [SMD LED WS2812B-1010RGBC]
P535  WS2812B  [SMD LED WS2812B-1010RGBC]
P536  WS2812B  [SMD LED WS2812B-1010RGBC]
P537  WS2812B  [SMD LED WS2812B-1010RGBC]
P538  WS2812B  [SMD LED WS2812B-1010RGBC]
P539  WS2812B  [SMD LED WS2812B-1010RGBC]
P540  WS2812B  [SMD LED WS2812B-1010RGBC]
P541  WS2812B  [SMD LED WS2812B-1010RGBC]
P542  WS2812B  [SMD LED WS2812B-1010RGBC]
P543  WS2812B  [SMD LED WS2812B-1010RGBC]
P544  WS2812B  [SMD LED WS2812B-1010RGBC]
P545  WS2812B  [SMD LED WS2812B-1010RGBC]
P546  WS2812B  [SMD LED WS2812B-1010RGBC]
P547  WS2812B  [SMD LED WS2812B-1010RGBC]
P548  WS2812B  [SMD LED WS2812B-1010RGBC]

## Ports
LED_MAT (in), LED_SIGN (in)